# EAGLE design PW_portable (EAGLE 6.1)
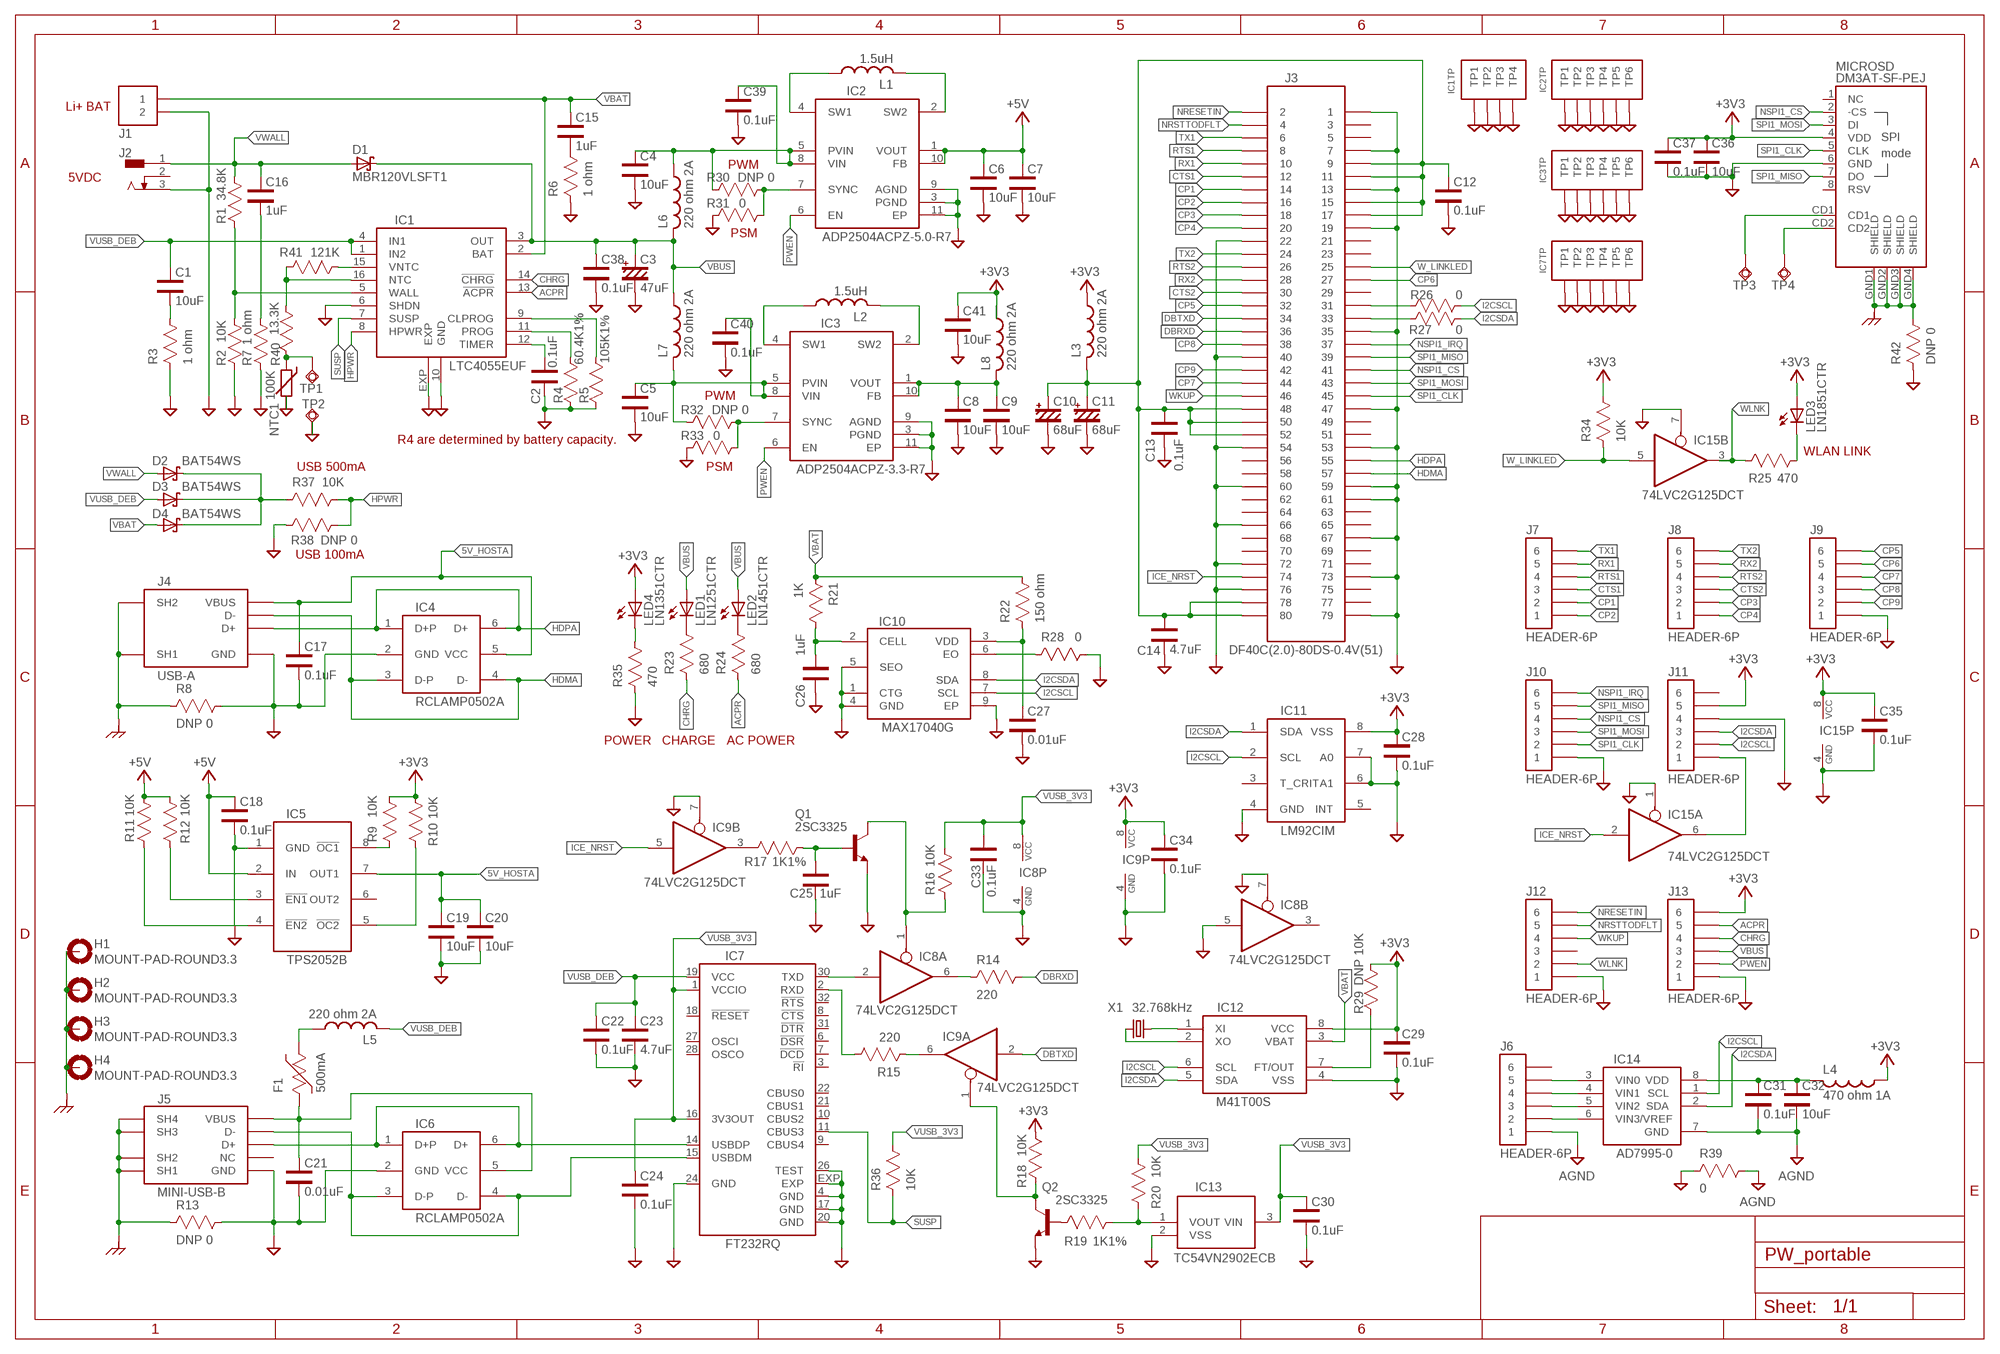
[diagram p0: schematic, sheet 1]

## Parts
C1  10uF  C0603  [C0603]
C2  0.1uF  C0603  [C0603]
C3  47uF  CPSMC_D  [SMC_D]
C4  10uF  C0603  [C0603]
C5  10uF  C0603  [C0603]
C6  10uF  C0603  [C0603]
C7  10uF  C0603  [C0603]
C8  10uF  C0603  [C0603]
C9  10uF  C0603  [C0603]
C10  68uF  CPSMC_D  [SMC_D]
C11  68uF  CPSMC_D  [SMC_D]
C12  0.1uF  C0603  [C0603]
C13  0.1uF  C0603  [C0603]
C14  4.7uF  C0603  [C0603]
C15  1uF  C0603  [C0603]
C16  1uF  C0603  [C0603]
C17  0.1uF  C0603  [C0603]
C18  0.1uF  C0603  [C0603]
C19  10uF  C0603  [C0603]
C20  10uF  C0603  [C0603]
C21  0.01uF  C0603  [C0603]
C22  0.1uF  C0603  [C0603]
C23  4.7uF  C0603  [C0603]
C24  0.1uF  C0603  [C0603]
C25  1uF  C0603  [C0603]
C26  1uF  C0603  [C0603]
C27  0.01uF  C0603  [C0603]
C28  0.1uF  C0603  [C0603]
C29  0.1uF  C0603  [C0603]
C30  0.1uF  C0603  [C0603]
C31  0.1uF  C0603  [C0603]
C32  10uF  C0603  [C0603]
C33  0.1uF  C0603  [C0603]
C34  0.1uF  C0603  [C0603]
C35  0.1uF  C0603  [C0603]
C36  10uF  C0603  [C0603]
C37  0.1uF  C0603  [C0603]
C38  0.1uF  C0603  [C0603]
C39  0.1uF  C0603  [C0603]
C40  0.1uF  C0603  [C0603]
C41  10uF  C0603  [C0603]
D1  MBR120VLSFT1  [SOD123FL]
D2  BAT54WS  [SOD323]
D3  BAT54WS  [SOD323]
D4  BAT54WS  [SOD323]
F1  500mA  NANOSMDC050F/13  [P1206]
H1  MOUNT-PAD-ROUND3.3  [3,3-PAD]
H2  MOUNT-PAD-ROUND3.3  [3,3-PAD]
H3  MOUNT-PAD-ROUND3.3  [3,3-PAD]
H4  MOUNT-PAD-ROUND3.3  [3,3-PAD]
IC1  LTC4055EUF  [QFN16-4X4]
IC2  ADP2504ACPZ-5.0-R7  [LFCSP_WD-CP-10-9]
IC3  ADP2504ACPZ-3.3-R7  [LFCSP_WD-CP-10-9]
IC4  RCLAMP0502A  [SOT666]
IC5  TPS2052B  [D_R-PDSO-G08]
IC6  RCLAMP0502A  [SOT666]
IC7  FT232RQ  [QFN32]
IC8  74LVC2G125DCT  [SSOP08]
IC9  74LVC2G125DCT  [SSOP08]
IC10  MAX17040G  [8-TDFN]
IC11  LM92CIM  [SO08]
IC12  M41T00S  [SO08]
IC13  TC54VN2902ECB  [SOT23]
IC14  AD7995-0  [SOT23-8]
IC15  74LVC2G125DCT  [SSOP08]
J1  JACK-JST-2P-PW'SMD'  [JST-SMD-2.0]
J2  DCJ0202  [DCJ0202]
J3  DF40C(2.0)-80DS-0.4V(51)  [DF40C(2.0)-80DS-0.4V(51)]
J4  USB-A  USB-AL  [USB-A]
J5  MINI-USB-B  [1734035-2]
J6  HEADER-6P  [6P-2.54]
J7  HEADER-6P  [6P-2.54]
J8  HEADER-6P  [6P-2.54]
J9  HEADER-6P  [6P-2.54]
J10  HEADER-6P  [6P-2.54]
J11  HEADER-6P  [6P-2.54]
J12  HEADER-6P  [6P-2.54]
J13  HEADER-6P  [6P-2.54]
L1  1.5uH  LQM2HPN1R5MG0L  [L1008]
L2  1.5uH  LQM2HPN1R5MG0L  [L1008]
L3  220 ohm 2A  BLM18PG  [L0603]
L4  470 ohm 1A  BLM18PG  [L0603]
L5  220 ohm 2A  BLM18PG  [L0603]
L6  220 ohm 2A  BLM18PG  [L0603]
L7  220 ohm 2A  BLM18PG  [L0603]
L8  220 ohm 2A  BLM18PG  [L0603]
LED1  LN1251CTR  [LED1208]
LED2  LN1451CTR  [LED1208]
LED3  LN1851CTR  [LED1208]
LED4  LN1351CTR  [LED1208]
MICROSD  DM3AT-SF-PEJ  [DM3AT-SF-PEJ]
NTC1  100K  NTHS0603  [R0603]
Q1  2SC3325  [SOT23-BEC]
Q2  2SC3325  [SOT23-BEC]
R1  34.8K  R0603  [R0603]
R2  10K  R0603  [R0603]
R3  1 ohm  R0603  [R0603]
R4  60.4K1%  R0603  [R0603]
R5  105K1%  R0603  [R0603]
R6  1 ohm  R0603  [R0603]
R7  1 ohm  R0603  [R0603]
R8  DNP 0  R0603  [R0603]
R9  10K  R0603  [R0603]
R10  10K  R0603  [R0603]
R11  10K  R0603  [R0603]
R12  10K  R0603  [R0603]
R13  DNP 0  R0603  [R0603]
R14  220  R0603  [R0603]
R15  220  R0603  [R0603]
R16  10K  R0603  [R0603]
R17  1K1%  R0603  [R0603]
R18  10K  R0603  [R0603]
R19  1K1%  R0603  [R0603]
R20  10K  R0603  [R0603]
R21  1K  R0603  [R0603]
R22  150 ohm  R0603  [R0603]
R23  680  R0603  [R0603]
R24  680  R0603  [R0603]
R25  470  R0603  [R0603]
R26  0  R0603  [R0603]
R27  0  R0603  [R0603]
R28  0  R0603  [R0603]
R29  DNP 10K  R0603  [R0603]
R30  DNP 0  R0603  [R0603]
R31  0  R0603  [R0603]
R32  DNP 0  R0603  [R0603]
R33  0  R0603  [R0603]
R34  10K  R0603  [R0603]
R35  470  R0603  [R0603]
R36  10K  R0603  [R0603]
R37  10K  R0603  [R0603]
R38  DNP 0  R0603  [R0603]
R39  0  R0603  [R0603]
R40  13.3K  R0603  [R0603]
R41  121K  R0603  [R0603]
R42  DNP 0  R0603  [R0603]
TP1  TPSQTP20SQ  [TP20SQ]
TP2  TPSQTP20SQ  [TP20SQ]
TP3  TPSQTP20SQ  [TP20SQ]
TP4  TPSQTP20SQ  [TP20SQ]
X1  32.768kHz  CRYSTALFC255  [FC255]

## Nets
5V_HOSTA: C17.1 C19.1 C20.1 IC4.5(VCC) IC5.7(OUT1) J4.1(VBUS)
+3V3: C28.1 C29.1 C34.1 C35.1 C36.1 C37.1 C41.1 IC9.8(P:VCC) IC11.8(VSS) IC12.8(VCC) IC15.8(P:VCC) J11.5 J13.6 L3.1 L4.1 L8.1 LED3.A LED4.A MICROSD.4(VDD) R9.2 R10.2 R18.1 R29.2 R34.2
+5V: C6.1 C7.1 C18.1 IC2.1(VOUT) IC2.10(FB) IC5.2(IN) R11.2 R12.2
ACPR: IC1.13(!ACPR) J13.5 R24.1
AGND: C31.2 C32.2 IC14.7(GND) J6.1 R39.2
CHRG: IC1.14(!CHRG) J13.4 R23.1
CP1: J3.14 J7.2
CP2: J3.16 J7.1
CP3: J3.18 J8.2
CP4: J3.20 J8.1
CP5: J3.32 J9.6
CP6: J3.27 J9.5
CP7: J3.44 J9.4
CP8: J3.38 J9.3
CP9: J3.42 J9.2
CTS1: J3.12 J7.3
CTS2: J3.30 J8.3
DBRXD: J3.36 R14.2
DBTXD: IC9.2(A:I) J3.34
DGND: C2.2 C3.- C4.2 C5.2 C6.2 C7.2 C8.2 C9.2 C10.- C11.- C12.2 C13.2 C14.2 C17.2 C18.2 C19.2 C20.2 C21.2 C22.2 C23.2 C24.2 C25.2 C26.2 C27.2 C28.2 C29.2 C30.2 C33.2 C34.2 C35.2 C36.2 C37.2 C38.2 C39.2 C40.2 C41.2 IC1.6(SHDN) IC1.10(GND) IC1.EXP IC1.P$1(TP1) IC1.P$2(TP2) IC1.P$3(TP3) IC1.P$4(TP4) IC2.3(PGND) IC2.9(AGND) IC2.11(EP) IC2.P$1(TP1) IC2.P$2(TP2) IC2.P$3(TP3) IC2.P$4(TP4) IC2.P$5(TP5) IC2.P$6(TP6) IC3.3(PGND) IC3.9(AGND) IC3.11(EP) IC3.P$1(TP1) IC3.P$2(TP2) IC3.P$3(TP3) IC3.P$4(TP4) IC3.P$5(TP5) IC3.P$6(TP6) IC4.2(GND) IC5.1(GND) IC6.2(GND) IC7.4(GND) IC7.17(GND) IC7.20(GND) IC7.24(GND) IC7.26(TEST) IC7.EXP IC7.P$1(TP1) IC7.P$2(TP2) IC7.P$3(TP3) IC7.P$4(TP4) IC7.P$5(TP5) IC7.P$6(TP6) IC8.4(P:GND) IC8.5(B:I) IC8.7(B:OE) IC9.4(P:GND) IC9.7(B:OE) IC10.1(CTG) IC10.4(GND) IC10.5(SEO) IC10.9(EP) IC11.4(GND) IC11.6(A1) IC11.7(A0) IC12.4(VSS) IC13.2(VSS) IC15.1(A:OE) IC15.4(P:GND) IC15.7(B:OE) J1.2 J2.3 J3.1 J3.7 J3.13 J3.19 J3.22 J3.35 J3.40 J3.47 J3.53 J3.54 J3.59 J3.60 J3.61 J3.66 J3.67 J3.72 J3.73 J3.76 J3.79 J4.4(GND) J5.5(GND) J9.1 J10.1 J11.4 J12.1 J13.1 MICROSD.6(GND) NTC1.2 Q1.E Q2.E R2.1 R3.1 R4.1 R5.1 R6.1 R7.1 R8.2 R13.2 R28.2 R31.1 R33.1 R35.1 R38.1 R39.1 R42.1 TP2.TP
EGND: H1.B3,3(MOUNT) H2.B3,3(MOUNT) H3.B3,3(MOUNT) H4.B3,3(MOUNT) J4.5(SH1) J4.6(SH2) J5.M1(SH1) J5.M2(SH2) J5.M3(SH3) J5.M4(SH4) MICROSD.GND1(SHIELD) MICROSD.GND2(SHIELD) MICROSD.GND3(SHIELD) MICROSD.GND4(SHIELD) R8.1 R13.1 R42.2
HDMA: IC4.3(D-P) IC4.4(D-) J3.57 J4.2(D-)
HDPA: IC4.1(D+P) IC4.6(D+) J3.55 J4.3(D+)
HPWR: IC1.8(HPWR) R37.2 R38.2
I2CSCL: IC10.7(SCL) IC11.2(SCL) IC12.6(SCL) IC14.1(SCL) J11.2 R26.2
I2CSDA: IC10.8(SDA) IC11.1(SDA) IC12.5(SDA) IC14.2(SDA) J11.3 R27.2
ICE_NRST: IC9.5(B:I) IC15.2(A:I) J3.74
N$1: NTC1.1 R40.1 TP1.TP
N$2: C26.1 IC10.2(CELL) R21.2
N$3: C2.1 IC1.12(TIMER)
N$4: C27.1 IC10.3(VDD) R22.1
N$5: IC1.5(WALL) R1.1 R2.2
N$6: C1.2 R3.2
N$7: IC1.11(PROG) R4.2
N$8: IC1.9(CLPROG) R5.2
N$9: IC2.4(SW1) L1.1
N$10: IC2.2(SW2) L1.2
N$11: IC3.4(SW1) L2.1
N$12: IC3.2(SW2) L2.2
N$13: C10.+ C11.+ C12.1 C13.1 C14.1 J3.9 J3.11 J3.15 J3.17 J3.48 J3.50 J3.52 J3.78 J3.80 L3.2
N$14: C16.2 R7.2
N$15: IC5.3(!EN1) R12.1
N$16: IC5.8(!OC1) R9.1
N$17: IC5.5(!OC2) R10.1
N$18: C15.2 R6.2
N$19: IC5.4(!EN2) R11.1
N$20: IC8.1(A:OE) Q1.C R16.1
N$21: IC6.1(D+P) IC6.6(D+) IC7.14(USBDP) J5.3(D+)
N$22: C21.1 F1.1 IC6.5(VCC) J5.1(VBUS)
N$23: IC6.3(D-P) IC6.4(D-) IC7.15(USBDM) J5.2(D-)
N$24: C25.1 Q1.B R17.1
N$25: IC9.1(A:OE) Q2.C R18.2
N$26: Q2.B R19.1
N$27: IC7.30(TXD) IC8.2(A:I)
N$28: IC7.2(RXD) R15.2
N$29: IC9.6(A:O) R15.1
N$30: IC8.6(A:O) R14.1
N$31: IC13.1(VOUT) R19.2 R20.1
N$32: IC10.6(EO) R28.1
N$33: IC9.3(B:O) R17.2
N$34: C31.1 C32.1 IC14.8(VDD) L4.2
N$35: IC12.2(XO) X1.1
N$36: LED1.C R23.2
N$37: LED2.C R24.2
N$38: IC14.6(VIN3/VREF) J6.2
N$39: IC14.5(VIN2) J6.3
N$40: IC14.4(VIN1) J6.4
N$41: IC14.3(VIN0) J6.5
N$42: IC15.6(A:O) J11.1
N$43: LED3.C R25.2
N$44: MICROSD.CD1 TP3.TP
N$45: IC12.1(XI) X1.2
N$46: IC12.7(FT/OUT) R29.1
N$47: J3.31 R26.1
N$48: J3.33 R27.1
N$49: IC2.7(SYNC) R30.2 R31.2
N$50: IC3.7(SYNC) R32.2 R33.2
N$51: MICROSD.CD2 TP4.TP
N$52: LED4.C R35.2
N$53: F1.2 L5.1
N$54: C5.1 C40.1 IC3.5(PVIN) IC3.8(VIN) L7.2 R32.1
N$55: C4.1 C39.1 IC2.5(PVIN) IC2.8(VIN) L6.1 R30.1
N$56: D2.C D3.C D4.C R37.1
N$57: IC1.15(VNTC) R41.1
N$58: IC1.16(NTC) R40.2 R41.2
N$59: C8.1 C9.1 IC3.1(VOUT) IC3.10(FB) L8.2
NRESETIN: J3.2 J12.6
NRSTTODFLT: J3.4 J12.5
NSPI1_CS: J3.41 J10.4 MICROSD.2(-CS)
NSPI1_IRQ: J3.37 J10.6
PWEN: IC2.6(EN) IC3.6(EN) J13.2
RTS1: J3.8 J7.4
RTS2: J3.26 J8.4
RX1: J3.10 J7.5
RX2: J3.28 J8.5
SPI1_CLK: J3.45 J10.2 MICROSD.5(CLK)
SPI1_MISO: J3.39 J10.5 MICROSD.7(DO)
SPI1_MOSI: J3.43 J10.3 MICROSD.3(DI)
SUSP: IC1.7(SUSP) IC7.11(CBUS3) R36.1
TX1: J3.6 J7.6
TX2: J3.24 J8.6
VBAT: C15.1 D4.A IC1.2(BAT) IC12.3(VBAT) J1.1 R21.1 R22.2
VBUS: C3.+ C38.1 D1.C IC1.3(OUT) J13.3 L6.2 L7.1 LED1.A LED2.A
VUSB_3V3: C24.1 C30.1 C33.1 IC7.1(VCCIO) IC7.16(3V3OUT) IC8.8(P:VCC) IC13.3(VIN) R16.2 R20.2 R36.2
VUSB_DEB: C1.1 C22.1 C23.1 D3.A IC1.1(IN2) IC1.4(IN1) IC7.19(VCC) L5.2
VWALL: C16.1 D1.A D2.A J2.1 R1.2
W_LINKLED: IC15.5(B:I) J3.25 R34.1
WKUP: J3.46 J12.4
WLNK: IC15.3(B:O) J12.2 R25.1
Unconnected: IC5.6(OUT2) IC7.3(!RI) IC7.6(!DSR) IC7.7(!DCD) IC7.8(!CTS) IC7.9(CBUS4) IC7.10(CBUS2) IC7.18(!RESET) IC7.21(CBUS1) IC7.22(CBUS0) IC7.27(OSCI) IC7.28(OSCO) IC7.31(!DTR) IC7.32(!RTS) IC8.3(B:O) IC11.3(T_CRIT) IC11.5(INT) J2.2 J3.3 J3.5 J3.21 J3.23 J3.29 J3.49 J3.51 J3.56 J3.58 J3.62 J3.63 J3.64 J3.65 J3.68 J3.69 J3.70 J3.71 J3.75 J3.77 J5.4(NC) J6.6 J11.6 J12.3 MICROSD.1(NC) MICROSD.8(RSV)

## Notes on the sheet
- Li+ BAT
- PWM
- 5VDC
- PSM
- PWM
- R4 are determined by battery capacity.
- WLAN LINK
- USB 500mA | PSM
- USB 100mA
- POWER | CHARGE | AC POWER

## Library data of the parts
C1 C2 C4-C9 C12-C41 = PWLib:C
C3 C10 C11 = PWLib:CP
D1 = PWLib:MBR120VLSFT1: Schottky Power Rectifier Source: http://www.onsemi.com/pub/Collateral/MBR120VLSFT1-D.pdf
D2-D4 = PWLib:BAT54WS: Schottky Power Rectifier
F1 = PWLib:NANOSMDC050F/13
H1-H4 = holes:MOUNT-PAD-ROUND: MOUNTING PAD, round
IC1 = PWLib:LTC4055EUF
IC2 IC3 = PWLib:ADP2504ACPZ-?-R7
IC4 IC6 = PWLib:RCLAMP0502A
IC5 = PWLib:TPS2052B
IC7 = PWLib:FT232R: Source: http://www.ftdichip.com/Documents/DataSheets/DS_FT232R_v104.pdf; MPN: FT232RQ; OC_FARNELL: 1146033; OC_NEWARK: 91K9919
IC8 IC9 IC15 = PWLib:74*2G125: Dual line drivers with 3-state outputs.
IC10 = PWLib:MAX17040*
IC11 = PWLib:LM92CIM
IC12 = PWLib:M41T00S
IC13 = PWLib:TC54VN*02E?
IC14 = PWLib:AD799*-
J1 = PWLib:JACK-JST-2P-PW
J2 = PWLib:DCJ0202: DC POWER JACK Source: DCJ0202.pdf; OC_FARNELL: unknown; OC_NEWARK: unknown
J3 = PWLib:DF40C(2.0)-80DS-0.4V(51)
J4 = PWLib:USB-A: USB-A Conector
J5 = PWLib:MINI-USB-B: MINI USB-B Conector
J6-J13 = PWLib:HEADER-6P
L1 L2 = PWLib:LQM2HPN1R5MG0L: INDUCTOR, American symbol
L3-L8 = PWLib:BLM?PG
LED1-LED4 = PWLib:LN*51CTR: CHIP TYPE LED LNxx51CTR
MICROSD = PWLib:DM3AT-SF-PEJ: HIROSE microSD socket DM3AT-SF-PEJ
NTC1 = PWLib:NTHS0603: Thermo Resistor
Q1 Q2 = PWLib:2SC3325
R1-R42 = PWLib:R
TP1-TP4 = testpad:TPSQ: Test pad
X1 = PWLib:CRYSTAL: CRYSTAL

## Board
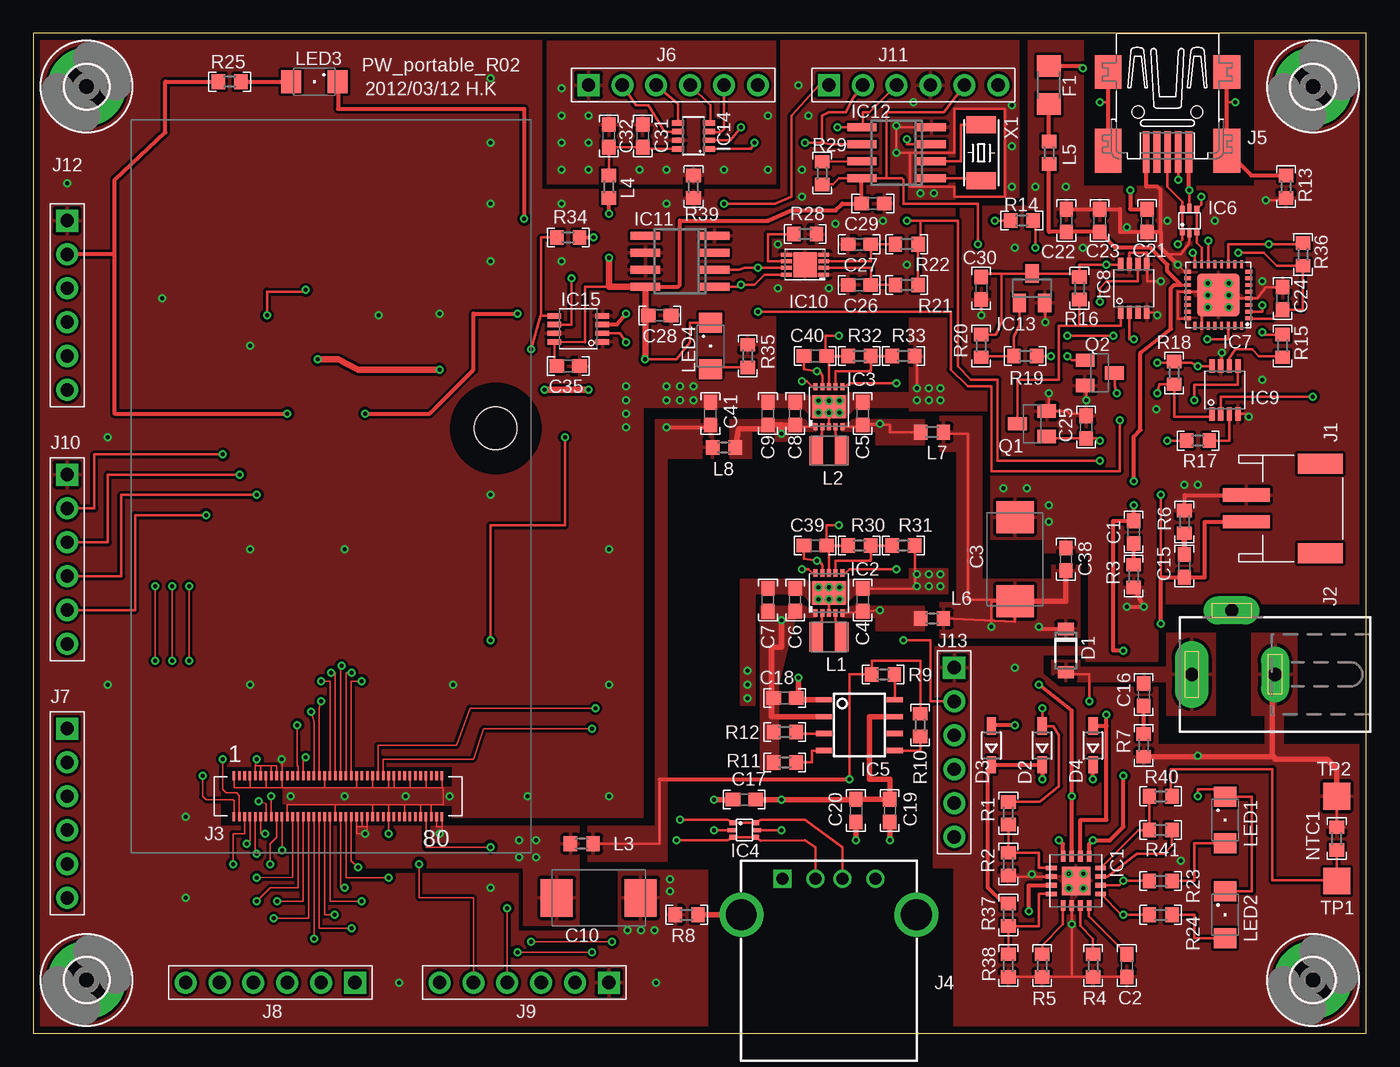
[diagram p1: board, top side]
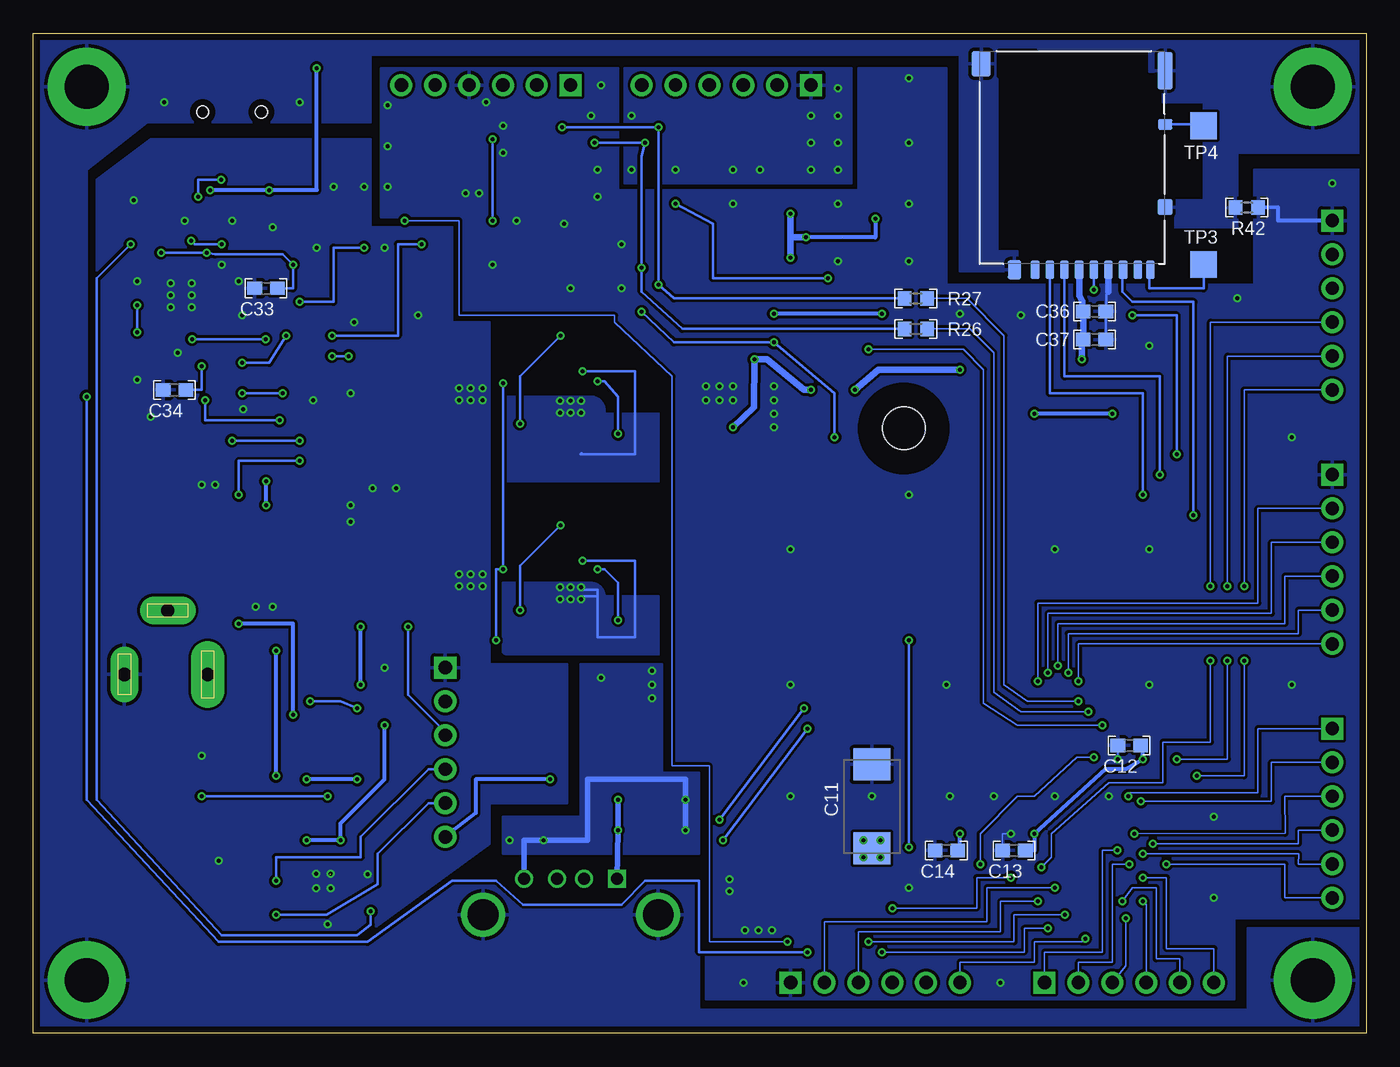
[diagram p2: board, bottom side, seen from below]

Size 100 x 75 mm. Coordinates in mm from the lower left corner, seen from the top.
Outline: 0,0 100,0 100,75 0,75 0,0
Copper layers (1*16): Top 0.035mm / dielectric 1.53mm / Bottom 0.035mm
Design rules: minimum track width 5mil, minimum drill 0.3mm, track to track 5mil, track to pad 0.229mm, pad to pad 5mil, via to via 5mil, smd to smd 5mil, copper to edge 0.5mm, drill to drill 0.5mm, minimum pad ring 0.15mm, minimum via ring 0.15mm, stop-mask expansion 4mil, vias tented up to drill 0.35mm, thermal gap 10mil

### Footprints (pad centres in the part's own frame; a part is rotated, then mirrored left to right if it is on the bottom)
C0603 = smd 1.1 x 1: 1 -0.85,0; 2 0.85,0
SMC_D = smd 2.4 x 2.8: + -3.15,0; - 3.15,0
SOD123FL = smd 0.91 x 1.22: A 1.625,0; C -1.625,0
SOD323 = smd 1.3 x 0.7: A 1.45,0; C -1.45,0
P1206 = smd 1.6 x 1.803: 1 -1.422,0; 2 1.422,0
3,3-PAD = drill 3.3 pad 5.842: B3,3 0,0
QFN16-4X4 = smd 0.8 x 0.35: 1 -1.85,0.975; 2 -1.85,0.325; 3 -1.85,-0.325; 4 -1.85,-0.975; 9 1.85,-0.975; 10 1.85,-0.325; 11 1.85,0.325; 12 1.85,0.975 | smd 0.35 x 0.8: 5 -0.975,-1.85; 6 -0.325,-1.85; 7 0.325,-1.85; 8 0.975,-1.85; 13 0.975,1.85; 14 0.325,1.85; 15 -0.325,1.85; 16 -0.975,1.85 | smd 2.15 x 2.15: EXP 0,0 | drill 0.3: P$1 -0.535,0.535; P$2 0.535,0.535; P$3 -0.535,-0.535; P$4 0.535,-0.535
LFCSP_WD-CP-10-9 = smd 0.55 x 0.3: 1 -1.5,1; 2 -1.5,0.5; 3 -1.5,0; 4 -1.5,-0.5; 5 -1.5,-1; 6 1.5,-1; 7 1.5,-0.5; 8 1.5,0; 9 1.5,0.5; 10 1.5,1 | smd 1.74 x 2.48: 11 0,0 | drill 0.3: P$1 -0.45,0.8; P$2 0.45,0.8; P$3 -0.45,0; P$4 0.45,0; P$5 -0.45,-0.8; P$6 0.45,-0.8
SOT666 = smd 0.375 x 0.5: 1 -0.537,-0.85; 3 0.538,-0.85; 4 0.538,0.849; 6 -0.538,0.85 | smd 0.3 x 0.65: 2 0,-0.923; 5 0,0.925
D_R-PDSO-G08 = smd 0.4 x 1.2: 1 -1.905,-2.65; 2 -0.635,-2.65; 3 0.635,-2.65; 4 1.905,-2.65; 5 1.905,2.65; 6 0.635,2.65; 7 -0.635,2.65; 8 -1.905,2.65
QFN32 = smd 0.6 x 0.3: 1 -2.3,1.75; 2 -2.3,1.25; 3 -2.3,0.75; 4 -2.3,0.25; 5 -2.3,-0.25; 6 -2.3,-0.75; 7 -2.3,-1.25; 8 -2.3,-1.75; 17 2.3,-1.75; 18 2.3,-1.25; 19 2.3,-0.75; 20 2.3,-0.25; 21 2.3,0.25; 22 2.3,0.75; 23 2.3,1.25; 24 2.3,1.75 | smd 0.3 x 0.6: 9 -1.75,-2.3; 10 -1.25,-2.3; 11 -0.75,-2.3; 12 -0.25,-2.3; 13 0.25,-2.3; 14 0.75,-2.3; 15 1.25,-2.3; 16 1.75,-2.3; 25 1.75,2.3; 26 1.25,2.3; 27 0.75,2.3; 28 0.25,2.3; 29 -0.25,2.3; 30 -0.75,2.3; 31 -1.25,2.3; 32 -1.75,2.3 | smd 3.2 x 3.2: EXP 0,0 | drill 0.3: P$1 -0.8,0.9; P$2 0.8,0.9; P$3 -0.8,0; P$4 0.8,0; P$5 -0.8,-0.9; P$6 0.8,-0.9
SSOP08 = smd 0.4 x 1: 1 -0.975,-1.8; 2 -0.325,-1.8; 3 0.325,-1.8; 4 0.975,-1.8; 5 0.975,1.8; 6 0.325,1.8; 7 -0.325,1.8; 8 -0.975,1.8
8-TDFN = smd 0.8 x 0.3: 1 -1.4,0.75; 2 -1.4,0.25; 3 -1.4,-0.25; 4 -1.4,-0.75; 5 1.4,-0.75; 6 1.4,-0.25; 7 1.4,0.25; 8 1.4,0.75 | smd 1.73 x 1.88: 9 0,0
SO08 = smd 0.6 x 2.2: 1 -1.905,-2.6; 2 -0.635,-2.6; 3 0.635,-2.6; 4 1.905,-2.6; 5 1.905,2.6; 6 0.635,2.6; 7 -0.635,2.6; 8 -1.905,2.6
SOT23 = smd 1 x 1.4: 1 -0.95,-1.1; 2 0.95,-1.1; 3 0,1.1
SOT23-8 = smd 0.4 x 0.9: 1 -0.975,-1.15; 2 -0.325,-1.15; 3 0.325,-1.15; 4 0.975,-1.15; 5 0.975,1.15; 6 0.325,1.15; 7 -0.325,1.15; 8 -0.975,1.15
JST-SMD-2.0 = smd 1 x 3.5: 1 -1,4.25; 2 1,4.25 | smd 1.5 x 3.4: P$1 -3.35,-1.3; P$2 3.35,-1.3
DCJ0202 = drill 1 pad 2.5 long: 1 0,3 | drill 1 pad 2.1 long: 2 4.8,0; 3 0,-3.25
DF40C(2.0)-80DS-0.4V(51) = smd 0.2 x 0.7: 1 -7.8,1.54; 2 -7.8,-1.54; 3 -7.4,1.54; 4 -7.4,-1.54; 5 -7,1.54; 6 -7,-1.54; 7 -6.6,1.54; 8 -6.6,-1.54; 9 -6.2,1.54; 10 -6.2,-1.54; 11 -5.8,1.54; 12 -5.8,-1.54; 13 -5.4,1.54; 14 -5.4,-1.54; 15 -5,1.54; 16 -5,-1.54; 17 -4.6,1.54; 18 -4.6,-1.54; 19 -4.2,1.54; 20 -4.2,-1.54; 21 -3.8,1.54; 22 -3.8,-1.54; 23 -3.4,1.54; 24 -3.4,-1.54; 25 -3,1.54; 26 -3,-1.54; 27 -2.6,1.54; 28 -2.6,-1.54; 29 -2.2,1.54; 30 -2.2,-1.54; 31 -1.8,1.54; 32 -1.8,-1.54; 33 -1.4,1.54; 34 -1.4,-1.54; 35 -1,1.54; 36 -1,-1.54; 37 -0.6,1.54; 38 -0.6,-1.54; 39 -0.2,1.54; 40 -0.2,-1.54; 41 0.2,1.54; 42 0.2,-1.54; 43 0.6,1.54; 44 0.6,-1.54; 45 1,1.54; 46 1,-1.54; 47 1.4,1.54; 48 1.4,-1.54; 49 1.8,1.54; 50 1.8,-1.54; 51 2.2,1.54; 52 2.2,-1.54; 53 2.6,1.54; 54 2.6,-1.54; 55 3,1.54; 56 3,-1.54; 57 3.4,1.54; 58 3.4,-1.54; 59 3.8,1.54; 60 3.8,-1.54; 61 4.2,1.54; 62 4.2,-1.54; 63 4.6,1.54; 64 4.6,-1.54; 65 5,1.54; 66 5,-1.54; 67 5.4,1.54; 68 5.4,-1.54; 69 5.8,1.54; 70 5.8,-1.54; 71 6.2,1.54; 72 6.2,-1.54; 73 6.6,1.54; 74 6.6,-1.54; 75 7,1.54; 76 7,-1.54; 77 7.4,1.54; 78 7.4,-1.54; 79 7.8,1.54; 80 7.8,-1.54 | hole 3.2: 11.836,27.584
USB-A = drill 0.9 pad 1.27 square: 1 3.5,-2.71 | drill 0.9 pad 1.27: 2 1,-2.71; 3 -1,-2.71; 4 -3.5,-2.71 | drill 2.3 pad 3.048: 5 6.57,0; 6 -6.57,0
1734035-2 = smd 3.1 x 0.5: 1 3,1.6; 2 3,0.8; 3 3,0; 4 3,-0.8; 5 3,-1.6 | smd 2.5 x 2: M1 -3,-4.45; M2 -3,4.45 | smd 3.3 x 2: M3 2.9,4.45; M4 2.9,-4.45 | hole 0.9: 0,2.2; 0,-2.2
6P-2.54 = drill 1 pad 1.651 square: 1 0,6.35 | drill 1 pad 1.651: 2 0,3.81; 3 0,1.27; 4 0,-1.27; 5 0,-3.81; 6 0,-6.35
L1008 = smd 1 x 2.2: 1 -0.95,0; 2 0.95,0
L0603 = smd 1 x 1.1: 1 -0.85,0; 2 0.85,0
LED1208 = smd 1.5 x 1.7: A -1.75,0; C 1.75,0
DM3AT-SF-PEJ = smd 0.65 x 1.4: 1 3.2,16.4; 2 2.1,16.4; 3 1,16.4; 4 -0.1,16.4; 5 -1.2,16.4; 6 -2.3,16.4; 7 -3.4,16.4; 8 -4.5,16.4; CD1 -5.45,16.4 | smd 1.1 x 0.8: CD2 -6.55,5.5 | smd 1.1 x 2.8: GND1 -6.55,1.475 | smd 1.4 x 1.9: GND2 7.25,0.95 | smd 1 x 1.4: GND3 4.75,16.4 | smd 1.1 x 1.2: GND4 -6.55,11.7
R0603 = smd 1 x 1.1: 1 -0.85,0; 2 0.85,0
SOT23-BEC = smd 1 x 1.4: B -0.95,-1.1; C 0,1.1; E 0.95,-1.1
TP20SQ = smd 2 x 2: TP 0,0
FC255 = smd 1.3 x 2.2: 1 -2.1,0; 2 2.1,0

### Placement (x,y rotation side)
C1  82.55,37.59 270 top
C2  82.04,5.08 270 top
C3  73.66,35.56 90 top
C4  62.23,32.51 90 top
C5  62.23,46.48 90 top
C6  57.15,32.51 90 top
C7  55.12,32.51 90 top
C8  57.15,46.48 90 top
C9  55.12,46.48 90 top
C10  42.42,10.16 0 top
C11  37.08,17.02 90 bottom
C12  17.78,21.59 180 bottom
C13  26.42,13.72 180 bottom
C14  31.5,13.72 180 bottom
C15  86.36,35.05 90 top
C16  83.31,25.4 270 top
C17  53.34,17.53 180 top
C18  56.39,25.15 0 top
C19  64.26,16.7 270 top
C20  61.72,16.7 270 top
C21  83.57,60.96 270 top
C22  77.51,60.96 90 top
C23  80,60.96 90 top
C24  93.73,55.12 90 top
C25  78.99,45.47 90 top
C26  61.98,56.13 180 top
C27  61.98,59.18 180 top
C28  46.99,53.85 0 top
C29  62.99,62.23 0 top
C30  71.12,55.88 270 top
C31  45.72,67.31 90 top
C32  43.18,67.31 90 top
C33  82.55,55.88 180 bottom
C34  89.41,48.26 180 bottom
C35  40.13,50.04 0 top
C36  20.38,54.15 0 bottom
C37  20.38,52.03 0 bottom
C38  77.47,35.56 90 top
C39  58.67,36.58 180 top
C40  58.67,50.8 180 top
C41  50.8,46.48 90 top
D1  77.47,28.7 270 top
D2  75.69,21.59 90 top
D3  71.88,21.59 90 top
D4  79.5,21.59 90 top
F1  76.2,71.12 270 top
H1  4,71 0 top
H2  96,71 0 top
H3  96,4 0 top
H4  4,4 0 top
IC1  78.23,11.43 270 top
IC2  59.69,33.02 90 top
IC3  59.69,46.99 90 top
IC4  53.34,15.24 270 top
IC5  61.98,23.11 270 top
IC6  86.74,60.96 0 top
IC7  88.9,55.37 180 top
IC8  82.55,55.88 0 top
IC9  89.41,48.26 0 top
IC10  57.91,57.66 180 top
IC11  48.51,57.91 90 top
IC12  64.77,66.04 90 top
IC13  74.93,55.88 0 top
IC14  49.53,67.31 90 top
IC15  40.89,52.83 90 top
J1  95.25,39.37 90 top
J2  89.92,26.92 90 top
J3  22.86,17.78 0 top
J4  59.69,8.89 180 top
J5  85.09,69.09 270 top
J6  48.01,71.12 90 top
J7  2.54,16.51 0 top
J8  17.78,3.81 270 top
J9  36.83,3.81 270 top
J10  2.54,35.56 0 top
J11  66.04,71.12 90 top
J12  2.54,54.61 0 top
J13  69.09,21.08 0 top
L1  59.69,29.72 180 top
L2  59.69,43.69 180 top
L3  41.15,14.22 180 top
L4  43.18,63.5 90 top
L5  76.2,66.04 270 top
L6  67.44,31.11 0 top
L7  67.44,45.09 180 top
L8  51.82,43.94 0 top
LED1  89.41,16 270 top
LED2  89.41,8.89 270 top
LED3  21.08,71.37 180 top
LED4  50.8,51.56 270 top
MICROSD  21.64,73.67 180 bottom
NTC1  97.79,14.61 90 top
Q1  74.93,45.72 90 top
Q2  80.01,49.53 270 top
R1  73.15,16.51 90 top
R2  73.15,12.7 90 top
R3  82.55,34.29 90 top
R4  79.5,5.08 90 top
R5  75.69,5.08 90 top
R6  86.36,38.35 270 top
R7  83.31,21.59 90 top
R8  49.02,8.89 180 top
R9  63.75,26.92 180 top
R10  66.55,23.11 90 top
R11  56.39,20.32 180 top
R12  56.39,22.61 180 top
R13  93.98,63.5 270 top
R14  74.17,60.96 180 top
R15  93.73,51.56 90 top
R16  78.49,55.88 90 top
R17  87.38,44.45 0 top
R18  85.6,49.53 270 top
R19  74.42,50.8 180 top
R20  71.12,51.56 90 top
R21  65.53,56.13 180 top
R22  65.53,59.18 0 top
R23  84.58,11.43 0 top
R24  84.58,8.89 0 top
R25  14.73,71.37 0 top
R26  33.78,52.83 180 bottom
R27  33.78,55.12 180 bottom
R28  57.91,59.94 0 top
R29  59.18,64.52 270 top
R30  61.98,36.58 0 top
R31  65.28,36.58 180 top
R32  61.98,50.8 0 top
R33  65.28,50.8 180 top
R34  40.13,59.69 0 top
R35  53.59,50.8 270 top
R36  95.25,58.42 270 top
R37  73.15,8.89 270 top
R38  73.15,5.08 90 top
R39  49.53,63.5 90 top
R40  84.58,17.78 180 top
R41  84.58,15.24 180 top
R42  8.95,61.93 180 bottom
TP1  97.79,11.43 0 top
TP2  97.79,17.78 0 top
TP3  12.19,57.66 0 bottom
TP4  12.19,68.07 0 bottom
X1  71.12,66.04 270 top

### Tracks (layer width: path | path; a pad name or v marks a point on that pad's centre or on a via)
5V_HOSTA  (via drill 0.3)
  Top 0.2: v56.13,15.24 IC4.5
  Top 0.4: C17.1 v56.13,17.53 61.72,17.53 C20.1 C19.1 64.26,19.05 62.74,19.05 62.74,23.75 IC5.7
  Bottom 0.4: v56.13,17.53 v56.13,15.24 J4.1
+3V3  (via drill 0.3)
  Top 0.2: R10.2 66.55,27.94 62.9,27.94 R9.2 62.74,26.75 62.74,26.92 61.21,26.92 v61.21,19.05 | IC9.8 88.41,50.04 v87.38,50.04 86.87,50.29 85.6,50.29 | 85.6,50.29 R18.1 | v84.32,50.29 85.6,50.29 | v77.6,52.32 v81.03,52.32 | 46.99,19.05 46.99,14.22 L3.1 | IC12.8 64.01,64.14 | 64.01,64.14 64.01,69.09 68.33,69.09 J11.5 | IC12.8 60.45,64.14 59.98,63.67 R29.2 | 62.14,64.11 IC12.8 | 64.01,64.14 65.15,64.14 65.28,64.01 65.28,62.23 70.87,62.23 v70.87,59.18 | IC11.8 45.91,54.46 C28.1 | C35.1 39.12,50.29 IC15.8 41.4,51.82 41.4,56.01 43.18,56.01 | LED4.A 49.28,53.31 49.28,51.82 48.26,50.55 v45.91,50.55 | 22.86,71.35 LED3.A | L4.1 43.18,62.74
  Top 0.3: 46.99,19.05 v61.21,19.05 | 62.14,64.11 C29.1 60.71,62.23 60.2,61.72 56.9,61.72 55.12,60.96 48.51,60.96 48.51,56.13 48.39,56.01 IC11.8 | v47.5,45.47 50.63,45.47 C41.1 | v43.18,61.47 L4.1 | 22.86,71.35 22.86,69.34 36.83,69.34 v36.83,61.09 | R34.2 v42.04,59.69
  Top 0.5: v43.18,58.17 43.18,56.01 IC11.8 45.91,51.11 v45.91,50.55 | v21.34,50.55 22.86,50.55 24.38,49.78 v30.48,49.78 | v38.35,48.26 v41.66,48.26
  Bottom 0.2: v87.38,50.04 87.38,48.26 C34.1 | C36.1 21.28,54.28 | v84.32,50.29 82.3,50.29 v81.03,52.32 | v77.6,52.32 72.64,52.32 72.64,59.18 v70.87,59.18 | 21.34,51.92 C37.1
  Bottom 0.3: J13.6 66.8,16.51 66.8,19.05 v61.21,19.05 | v36.83,61.09 36.83,59.69 v42.04,59.69
  Bottom 0.5: C37.1 C36.1 | 21.28,54.28 21.28,54.9 21.54,55.33 MICROSD.4 | v47.5,45.47 45.92,46.97 v45.91,50.55 44.96,50.55 42.16,48.26 v41.66,48.26 | v21.34,50.55 21.34,51.92 | v43.18,58.17 43.18,59.69 | 43.18,59.69 v43.18,61.47 | v30.48,49.78 36.58,49.78 v38.35,48.26 | v42.04,59.69 43.18,59.69
  pour Top (isolate 0.2): 51.31,45.97 46.74,45.97 46.74,15.49 41.66,15.49 41.66,12.95 47.5,12.95 47.5,43.18 51.31,43.18
+5V  (via drill 0.3)
  Top 0.2: IC2.10 58.44,34.52 58.17,34.8 v57.66,34.8 | v56.13,30.99 56.22,30.73 C6.1
  Top 0.4: v56.13,30.99 56.13,28.96 55.37,28.96 55.37,23.75 IC5.2
  Bottom 0.2: v57.66,34.8 57.15,34.8 56.13,33.78 v56.13,30.99
  pour Top (isolate 0.127, no thermals): 55.88,26.16 57.15,31.24 58.67,31.24 58.67,31.75 58.29,31.75 57.91,32 54.61,32 54.61,19.81 55.88,19.81
ACPR  (via drill 0.3)
  Top 0.2: IC1.13 81.65,8.89 v81.79,8.89 R24.1
  Bottom 0.2: J13.5 70.36,17.27 74.17,13.46 74.17,11.18 77.98,8.89 v81.79,8.89
AGND  (via drill 0.3)
  other vias: 39.62,70.87 39.62,68.83 41.66,68.83 39.62,66.8 41.66,66.8 39.62,64.77 41.66,64.77 45.47,64.77 47.5,64.77 55.12,64.77 51.82,64.77 55.12,68.83
  pour Top (isolate 0.2): 38.61,74.42 55.63,74.42 55.63,63.75 38.61,63.75
  pour Bottom (isolate 0.2): 38.61,72.39 55.63,72.39 55.63,63.75 38.61,63.75
CHRG  (via drill 0.3)
  Top 0.2: IC1.14 81.46,11.11 v81.79,11.43 R23.1
  Bottom 0.2: J13.4 70.36,19.81 75.44,14.73 75.44,13.21 81.79,13.21 v81.79,11.43
CP1  (via drill 0.3)
  Top 0.127: J3.14 17.46,17.21 v16.89,17.4
  Bottom 0.127: v16.89,17.4 7.11,17.4 7.11,20.32 J7.2
CP2  (via drill 0.3)
  Top 0.127: v17.86,17.79 J3.16
  Bottom 0.127: v17.86,17.79 17.86,18.03 8.13,18.03 8.13,22.86 J7.1
CP3  (via drill 0.3)
  Top 0.127: J3.18 18.26,14.7 17.78,14.22 v17.78,12.7
  Bottom 0.127: v17.78,12.7 19.05,12.7 19.05,5.33 21.59,5.33 J8.2
CP4  (via drill 0.3)
  Top 0.127: J3.20 v18.66,13.72 v18.67,13.72
  Bottom 0.127: v18.67,13.72 19.81,13.72 19.81,6.1 24.13,6.1 J8.1
CP5  (via drill 0.3)
  Top 0.127: J3.32 21.06,7.11 v21.08,7.11
  Bottom 0.127: v21.08,7.11 21.34,6.86 24.89,6.86 24.89,5.33 30.48,5.33 J9.6
CP6  (via drill 0.3)
  Top 0.127: J3.27 20.26,20.57 v20.45,20.7 | J9.5 33.02,10.16 28.96,10.16 v28.96,12.7
  Bottom 0.127: v20.45,20.7 21.72,20.7 24.89,17.78 26.16,17.78 28.96,14.99 v28.96,12.7
CP7  (via drill 0.3)
  Top 0.127: J3.44 23.46,11.68 v26.67,11.68 | v35.56,9.4 J9.4
  Bottom 0.127: v26.67,11.68 29.21,11.68 29.21,9.4 v35.56,9.4
CP8  (via drill 0.3)
  Top 0.127: J3.38 22.26,9.91 v24.64,9.91
  Bottom 0.127: v24.64,9.91 27.43,9.91 27.43,7.62 38.1,7.62 J9.3
CP9  (via drill 0.3)
  Top 0.127: J3.42 23.06,10.92 v23.37,10.92
  Bottom 0.127: v23.37,10.92 28.45,10.92 28.45,8.38 40.64,8.38 J9.2
CTS1  (via drill 0.3)
  Top 0.127: J3.12 17.06,14.99 v17.4,14.99
  Bottom 0.127: v17.4,14.99 6.09,15 6.1,17.78 J7.3
CTS2  (via drill 0.3)
  Top 0.127: J3.30 20.66,8.64 v18.03,8.64
  Bottom 0.127: v18.03,8.64 18.03,5.08 J8.3
DBRXD  (via drill 0.3)
  Top 0.127: J3.36 21.86,8.89 v22.61,8.89 | v37.34,6.86 v43.43,6.86
  Top 0.2: v72.14,60.96 R14.2
  Bottom 0.127: v22.61,8.89 26.42,8.89 26.42,6.86 v37.34,6.86 | v43.43,6.86 49.28,6.86 49.28,20.07 52.07,20.07 52.07,49.28 56.39,53.34 56.39,53.85 68.07,53.85 68.07,60.96 v72.14,60.96
DBTXD  (via drill 0.3)
  Top 0.127: J3.34 21.46,7.87 v23.88,7.87 | v36.32,6.1 v41.91,6.1
  Top 0.2: IC9.2 89.08,47.75 v96.01,47.75
  Bottom 0.127: v23.88,7.87 25.65,7.87 25.65,6.1 v36.32,6.1
  Bottom 0.2: v96.01,47.75 96.01,17.53 86.11,6.86 74.93,6.86 68.58,11.43 65.28,11.43 63.25,9.65 55.88,9.65 54.1,11.43 50.04,11.43 50.04,6.1 v41.91,6.1
DGND  (via drill 0.3)  (1 unrouted)
  Top 0.127: 24.26,18.41 J3.47 | 24.26,18.41 21.91,18.41 arc-90 21.86,18.46 | 21.86,18.46 J3.35 | 18.66,18.41 J3.19 v18.66,20.57 v18.65,20.57 | 18.66,18.41 21.81,18.41 arc90 21.86,18.46 | J3.1 15.06,18.41 16.26,18.41 | 16.26,18.41 17.46,18.41 | 16.26,18.41 J3.7 | 17.46,18.41 J3.13 | 17.46,18.41 18.66,18.41 | v26.67,14.99 v26.66,14.99 J3.60 26.66,17.14 | 29.86,17.14 J3.76 | 29.06,17.14 J3.72 | 29.86,17.14 29.06,17.14 | 27.86,17.14 J3.66 | 29.06,17.14 27.86,17.14 | 29.86,17.14 30.73,17.14 30.73,18.41 30.66,18.41 | 27.86,17.14 26.66,17.14 | 25.46,17.14 J3.54 | 26.66,17.14 25.46,17.14 | 22.66,17.14 J3.40 | 25.46,17.14 22.66,17.14 | J3.22 19.06,17.14 22.66,17.14 | 30.66,18.41 J3.79 | 29.46,18.41 J3.73 | 29.46,18.41 30.66,18.41 | 28.26,18.41 J3.67 | 27.06,18.41 J3.61 | 27.06,18.41 28.26,18.41 | 26.66,18.41 J3.59 | 26.66,18.41 27.06,18.41 | 25.46,18.41 J3.53 | 25.46,18.41 26.66,18.41 | 28.26,18.41 29.46,18.41 | 24.26,18.41 25.46,18.41
  Top 0.2: IC2.3 IC2.11 | C4.2 66.13,33.36 R31.1 | IC4.2 v51.05,15.24 | IC2.9 59.19,35.04 arc90 v58.8,35.43 57.84,35.59 C39.2 | IC3.3 IC3.P$3 | IC1.10 77.91,4.23 R4.1 | R4.1 C2.2 | R4.1 R5.1 R38.1 | 77.91,11.43 IC1.EXP arc90 77.91,11.76 77.72,11.76 77.72,11.94 | TP2.TP NTC1.2 | IC1.6 73.25,11.76 arc-90 R2.1 | R33.1 66.29,50.8 v66.29,48.39 | IC3.9 59.19,49.27 arc90 v58.8,49.66 57.82,49.82 C40.2 | 89.92,55.37 arc90 90.17,55.12 IC7.4 91.82,55.12 92.46,55.97 C24.2 | 87.63,55.62 IC7.20 85.85,55.62 85.85,53.59 86.6,53.59 IC7.24 | IC7.26 87.65,54.36 | IC6.2 86.74,59.31 86.11,58.42 85.09,58.42 | IC7.17 86.57,57.15 86.36,57.15 v85.85,57.66 | IC9.4 91.12,46.48 v91.19,46.23 | IC8.4 84.26,54.05 v84.33,53.85 | IC9.7 89.15,50.13 v89.15,51.05 | v84.58,56.39 83.57,56.39 83.57,57.64 IC8.5 83.53,58.55 82.22,58.55 IC8.7 | R13.2 93.81,62.48 v92.46,62.48 | v76.2,48.01 76.2,46.84 Q1.E 77.54,46.67 77.72,46.48 78.83,46.48 C25.2 | Q2.E 78.99,48.5 v78.99,47.5 | IC13.2 arc-90 75.95,54.71 v75.95,53.34 | C30.2 v71.12,53.85 | IC12.4 64.77,67.94 v64.77,66.04 65.79,66.04 | 65.79,66.04 69.09,66.04 69.09,69.34 72.9,69.34 72.9,62.74 69.09,62.74 69.09,63.5 65.79,63.5 65.79,66.04
  Top 0.3: v85.85,57.66 85.09,58.42 84.58,58.93 84.58,60.11 | R3.1 v83.31,32 v82.04,32 | 84.58,60.11 C21.2 81.53,60.11 81.53,61.81 C23.2 C22.2 | J5.5 83.49,63.5 84.33,63.5 84.58,63.25 84.58,60.11 | R6.1 86.38,40.37 J1.2
  Top 0.4: 57.4,25.02 57.24,25.02 C18.2 | 57.4,25.02 v57.4,26.67 | 57.4,25.02 IC5.1 | v61.72,14.48 C20.2 | v64.26,14.48 C19.2 | R7.1 92.88,20.74 arc90 92.96,20.83 | 92.96,20.83 92.96,26.88 arc90 J2.3 | TP2.TP 97.79,19.81 97.03,20.57 93.22,20.57 92.96,20.83 | v51.05,17.53 C17.2
  Top 0.406: 87.65,54.36 88.1,54.36 IC7.P$2
  Bottom 0.127: v18.65,20.57 18.63,20.57 C12.2 | v26.67,14.99 27.3,14.99 27.3,13.72
  Bottom 0.2: 57.66,32.77 58.86,32.77 | 58.86,33.27 57.66,33.27 57.66,29.72 54.86,29.72 54.86,35.43 v58.8,35.43 | 58.86,43.5 58.93,43.43 54.86,43.43 54.86,49.66 v58.8,49.66 | 19.33,55.61 19.51,55.4 19.51,54.1 C36.2 C37.2
  Bottom 0.3: R42.1 6.6,61.95 6.6,60.96 J12.1
  Bottom 0.4: v51.05,15.24 v51.05,17.53 51.05,19.05 58.42,19.05 58.42,14.48 v61.72,14.48 63.2,14.48 J4.4
  Bottom 0.5: 19.33,55.61 MICROSD.6
  other vias: 53.59,27.18 53.59,26.16 53.59,25.15 72.77,40.89 76.2,38.35 74.55,40.89 76.2,39.62 66.29,34.42 67.18,34.42 68.07,34.42 66.29,33.53 67.18,33.53 68.07,33.53 67.18,48.39 68.07,48.39 66.29,47.5 67.18,47.5 68.07,47.5 86.36,41.15 87.38,41.15 44.58,7.75 45.59,7.75 46.61,7.75 47.75,10.67 47.75,11.56 47.5,48.51 48.51,48.51 49.53,48.51 47.5,47.5 48.51,47.5 49.53,47.5 39.62,62.23 73.41,66.55 47.5,62.23 73.41,63.5 64.77,68.07 34.29,62.23 66.55,62.99 67.56,62.99 57.4,71.12 58.17,68.83 66.04,69.85 73.41,69.6 57.66,64.77 57.66,62.74 60.2,60.71 63.75,60.96 59.69,55.88 55.88,55.88 55.88,59.18 65.53,57.66 44.45,48.51 44.45,47.5 44.45,46.48 44.45,45.47 39.62,57.91 30.48,53.98 34.29,57.91 73.66,58.93 78.74,58.93 77.47,63.5 75.18,63.5 82.04,60.45 85.09,60.96 88.65,60.96 92.2,56.39 92.2,49.02 84.27,46.79 74.93,11.94 86.08,12.95 87.38,20.83 73.66,27.43 34.29,10.92 27.43,3.81 46.74,3.81 11.43,10.16 11.43,16.26 5.59,26.16 16.26,26.16 43.18,17.78 43.18,26.16 31.5,26.16 25.91,53.85 16.26,51.56 16.26,36.32 23.37,36.32 2.54,63.75 9.65,55.12 5.59,44.7 34.29,40.39 43.18,36.32 34.29,66.8 77.92,8.19 19.3,17.78 23.37,17.78 27.94,17.78 31.24,17.78 37.08,17.78 34.29,71.63
  pour Top (isolate 0.127, no thermals): 53.09,24.64 54.1,24.64 54.1,33.02 57.66,33.02 58.42,32.26 60.96,32.26 61.72,33.02 68.58,33.02 68.58,34.8 65.79,34.8 65.79,34.04 61.21,34.04 60.96,33.78 58.17,33.78 57.91,34.04 53.09,34.04
  pour Bottom (isolate 0.2, no thermals): 53.09,32.77 57.15,32.77 arc-90 58.17,33.78 64.77,33.78 64.77,28.7 arc-90 64.52,28.45 53.09,28.45
  pour Bottom (isolate 0.2): 52.83,27.69 58.93,27.69 58.93,16.26 64.77,16.26 64.77,13.46 50.04,13.46 50.04,19.56 52.83,19.56
  pour Bottom (isolate 0.2): 65.79,53.34 68.58,53.34 68.58,60.45 74.68,60.45 74.68,67.06 91.19,67.06 95.25,64.01 95.25,17.53 85.85,7.62 76.2,7.62 76.2,13.21 76.45,13.46 85.6,13.46 91.19,19.05 91.19,28.7 93.22,30.73 93.22,34.29 65.79,34.29
  pour Top (isolate 0.127, no thermals): 44.45,49.02 52.32,49.02 52.32,48.39 55.63,48.39 55.63,47.88 57.78,47.88 58.42,47.75 60.96,47.75 61.21,48.01 65.79,48.01 65.79,48.77 68.58,48.77 68.58,46.99 61.72,46.99 60.96,46.23 58.42,46.23 57.66,46.99 44.45,46.99
  pour Bottom (isolate 0.2): 65.79,34.8 93.22,34.8 93.73,34.29 93.73,19.81 93.47,19.56 92.96,19.56 82.3,7.37 75.18,7.37 65.79,14.22 65.79,17.27 59.94,17.27 59.94,27.69 65.79,27.69
  pour Bottom (isolate 0.2): 53.09,41.4 64.77,41.4 64.77,47.75 58.17,47.75 arc90 57.15,46.74 57.15,46.48 53.09,46.48
  pour Top (isolate 0.2): -0.51,75.44 38.1,75.44 38.1,63.25 56.13,63.25 56.13,75.44 73.91,75.44 73.91,69.34 69.09,69.34 69.09,54.36 55.63,54.36 55.63,46.99 45.72,46.99 45.72,16.26 31.5,16.26 31.5,17.02 31.5,18.54 31.5,20.07 13.97,20.07 13.97,15.49 23.62,15.49 23.62,11.94 36.32,11.94 36.32,7.62 43.94,7.62 43.94,12.19 50.55,12.19 50.55,-0.51 -0.51,-0.51
  pour Bottom (isolate 0.2): 49.53,2.54 9.91,2.54 9.91,8.64 -0.51,8.64 -0.51,64.77 8.38,64.77 8.38,56.13 31.5,56.13 31.5,72.39 38.1,72.39 38.1,63.25 56.13,63.25 56.13,72.39 73.91,72.39 73.91,61.21 68.07,61.21 68.07,53.85 56.39,53.85 56.39,53.34 52.32,49.53 52.32,20.07 49.53,20.07
  pour Top (isolate 0.127, no thermals): 85.6,41.66 88.14,41.66 88.14,40.13 85.6,40.13
  pour Top (isolate 0.2): 72.9,69.6 73.91,69.6 73.91,62.74 72.9,62.74
  pour Top (isolate 0.2): 69.09,-1.78 69.09,12.45 67.56,12.45 67.56,28.96 79.25,28.96 79.25,36.07 75.95,36.07 75.95,37.08 71.88,37.08 71.88,46.74 65.79,46.74 65.79,53.59 69.6,53.59 69.6,61.98 74.68,61.98 74.68,75.69 78.74,75.69 78.74,63.5 91.69,63.5 91.69,75.69 100.58,75.69 100.58,32.26 84.33,32.26 84.33,27.94 78.99,27.94 78.99,28.45 75.69,28.45 75.69,26.92 76.96,25.91 84.33,25.91 84.33,21.59 100.58,21.59 100.58,-1.78
  pour Top (isolate 0.127): 31.75,18.41 18.8,18.41 18.8,17.14 31.75,17.14
  pour Top (isolate 0.2): 92.46,21.34 92.46,23.88 91.44,23.88 91.44,29.97 94.74,29.97 94.74,23.88 93.73,23.88 93.73,21.34
EGND  (via drill 0.3)
  Top 0.2: 80.64,69.85 v80.01,69.85 | 89.54,69.85 v90.17,69.85
  Top 0.3: J5.M4 80.64,69.85 J5.M1 | J5.M2 89.54,69.85 J5.M3 91.38,64.35 R13.1
  Top 0.4: R8.1 J4.5
  pour Bottom (isolate 0.2): -0.25,75.18 100.33,75.18 100.33,-0.25 -0.25,-0.25 -0.25,7.87 8.89,7.87 8.89,1.78 50.04,1.78 50.04,11.43 54.1,11.43 55.88,9.65 63.25,9.65 65.28,11.43 68.58,11.43 74.93,6.86 86.11,6.86 96.01,17.53 96.01,64.77 91.44,68.33 74.68,68.33 74.68,73.41 30.48,73.41 30.48,57.15 26.16,57.15 26.16,58.67 27.69,58.67 27.69,73.66 16.26,73.66 16.26,72.14 15.24,72.14 15.24,69.85 12.19,69.85 12.19,62.48 15.49,62.48 15.49,61.47 14.48,61.47 14.48,60.45 9.65,60.45 9.65,66.04 -0.25,66.04
HDMA  (via drill 0.3)
  Top 0.127: J3.57 26.26,20.57 33.02,20.57 33.78,22.86 v41.91,22.86
  Top 0.2: J4.2 58.67,13.97 57.91,14.48 54.61,14.45 IC4.4 IC4.3 52.07,14.48 v48.26,14.48
  Bottom 0.2: v41.91,22.86 v48.26,14.48
HDPA  (via drill 0.3)
  Top 0.127: J3.55 25.86,21.59 31.75,21.59 32.77,24.38 v42.16,24.38
  Top 0.2: J4.3 60.71,13.97 57.91,16 54.6,16 IC4.6 IC4.1 52.07,16 v48.51,16
  Bottom 0.2: v42.16,24.38 v48.51,16
HPWR
  Top 0.2: R38.2 R37.2 75.44,8.04 75.44,10.41 arc-90 75.48,10.46 IC1.8
I2CSCL  (via drill 0.3)
  Top 0.2: IC12.6 59.82,66.67 59.18,66.8 | 59.18,66.8 59.18,68.83 59.69,69.09 60.97,69.09 61.47,70.1 J11.2 | v57.91,66.8 59.18,66.8 | v54.1,66.8 53.85,66.33 IC14.1 | IC10.7 v54.36,57.4 53.34,57.4 52.96,57.28 IC11.2
  Bottom 0.2: v57.91,66.8 v54.1,66.8 54.36,65.79 v54.36,57.4 54.36,55.63 51.31,52.83 R26.2
I2CSDA  (via drill 0.3)
  Top 0.2: J11.3 62.75,69.1 62.75,69.09 62.23,69.09 62.23,68 IC12.5 v60.33,67.94 | v53.09,67.94 52.32,66.98 IC14.2 | IC10.8 54.86,56.9 54.1,56.13 v53.09,56.13 52.96,56.01 IC11.1
  Bottom 0.2: v60.33,67.94 v53.09,67.94 v53.09,56.13 51.94,55.12 R27.2
ICE_NRST  (via drill 0.3)
  Top 0.127: J3.74 29.46,14.22 29.46,13.97 v34.29,13.97
  Top 0.2: IC9.5 90.38,48.64 87.12,48.64 v87.12,47.5 | v81.53,45.97 81.53,42.16 71.88,42.16 71.88,48.52 70.1,48.52 68.84,49.78 68.84,54.1 v54.36,54.1 | v44.45,51.82 44.01,52.51 IC15.2 | v34.29,29.46 34.29,38.1 39.88,38.1 v39.88,44.7
  Bottom 0.2: v87.12,47.5 87.12,45.97 v81.53,45.97 | v54.36,54.1 51.94,51.82 v44.45,51.82 39.88,48.01 v39.88,44.7 | v34.29,13.97 v34.29,29.46
N$1
  Top 0.2: R40.1 85.34,18.03 85.34,19.81 92.96,19.81 92.96,11.47 97.79,11.47 TP1.TP | TP1.TP NTC1.1 TP1.TP
N$2
  Top 0.2: R21.2 C26.1 62.83,57.41 IC10.2
N$3
  Top 0.2: IC1.12 79.21,8.77 C2.1
N$4
  Top 0.2: R22.1 C27.1 62.83,57.91 IC10.3
N$5
  Top 0.2: IC1.5 75.48,12.4 arc-90 75.44,12.45 75.44,13.55 R2.2 R1.1
N$6
  Top 0.3: R3.2 C1.2
N$7
  Top 0.2: IC1.11 78.56,8.06 79.5,7.11 R4.2
N$8
  Top 0.2: IC1.9 77.26,8.17 75.69,6.6 R5.2
N$9
  Top 0.2: IC2.4 60.2,30.99 L1.1
N$10
  Top 0.2: IC2.2 59.18,30.99 L1.2
N$11
  Top 0.2: IC3.4 60.19,44.97 60.2,44.96 L2.1
N$12
  Top 0.2: IC3.2 59.18,44.96 L2.2
N$13  (via drill 0.3)
  Top 0.127: J3.9 16.66,20.06 | 16.66,20.06 v16.76,20.57 | J3.17 18.26,20.06 17.86,20.06 | 17.86,20.06 J3.15 | 17.06,20.06 17.86,20.06 | 17.06,20.06 J3.11 | 16.66,20.06 17.06,20.06 | 30.66,15.49 30.66,14.99 v30.48,14.99 | 30.66,15.49 J3.80 | J3.78 30.26,15.49 30.66,15.49 | 25.06,15.49 25.06,14.99 v24.89,14.99 24.26,14.99 J3.48 24.26,15.49 24.66,15.49 | 25.06,15.49 J3.52 | 24.66,15.49 J3.50 | 25.06,15.49 24.66,15.49
  Bottom 0.127: 16.76,21.59 C12.1 | C14.1 30.48,13.72 | 24.89,13.72 C13.1
  Bottom 0.3: 16.76,21.59 v16.76,20.57 18.03,19.81 19.56,19.81 v24.89,14.99 24.89,13.72 | 30.48,13.72 v30.48,14.99
  Bottom 0.406: C11.+ 36.45,13.87 v36.45,14.48
  other vias: 37.72,14.48 36.45,13.21 37.72,13.21
  pour Top (isolate 0.254): 24.13,15.49 40.89,15.49 40.89,8.13 36.83,8.13 36.83,12.45 24.13,12.45
N$14
  Top 0.3: R7.2 C16.2
N$15
  Top 0.2: R12.1 57.15,22.35 57.15,22.48 IC5.3
N$16
  Top 0.2: R9.1 64.63,26.84 IC5.8
N$17
  Top 0.2: R10.1 66.55,21.21 IC5.5
N$18
  Top 0.4: R6.2 C15.2
N$19
  Top 0.2: R11.1 58.42,20.32 58.42,21.21 IC5.4
N$20
  Top 0.2: IC8.1 81.58,53.09 78.49,53.09 | 78.49,53.09 R16.1 | 78.49,53.09 76.96,53.09 76.96,49.02 73.83,49.02 Q1.C
N$21  (via drill 0.3)
  Top 0.2: J5.3 85.09,63.5 86.2,62.39 IC6.6 IC6.1 86.2,59.53 v85.85,59.18 | IC7.14 88.15,59.42 v88.14,59.44
  Bottom 0.2: v88.14,59.44 87.88,59.18 v85.85,59.18
N$22  (via drill 0.3)
  Top 0.2: v86.74,63.25 IC6.5
  Top 0.3: v78.74,72.39 78.74,72.54 F1.1 | J5.1 86.69,63.3 arc90 v86.74,63.25 | C21.1 82.3,61.81 v82.3,63.25
  Bottom 0.3: v86.74,63.25 v82.3,63.25 78.74,63.25 v78.74,72.39
N$23  (via drill 0.3)
  Top 0.2: J5.2 85.89,64.03 arc90 v85.92,64.01 | v87.63,62.74 87.63,62.16 IC6.4 IC6.3 87.28,59.28 87.65,58.91 IC7.15
  Bottom 0.2: v85.92,64.01 87.63,64.01 v87.63,62.74
N$24  (via drill 0.3)
  Top 0.2: v85.09,44.45 R17.1 | v80.02,44.45 79.85,44.62 C25.1 76.18,44.62 Q1.B
  Bottom 0.2: v80.02,44.45 v85.09,44.45
N$25  (via drill 0.3)
  Top 0.2: IC9.1 88.2,46.23 85.6,46.23 R18.2 84.49,48.68 v84.32,48.01 | Q2.C 81.13,48.51 v81.3,48.01
  Bottom 0.2: v81.3,48.01 v84.32,48.01
N$26  (via drill 0.3)
  Top 0.2: R19.1 v76.33,50.8 | v77.6,50.8 77.92,50.48 Q2.B
  Bottom 0.2: v76.33,50.8 v77.6,50.8
N$27  (via drill 0.3)
  Top 0.2: IC7.30 89.66,53.07 89.66,52.07 v88.1,52.07 | v82.57,52.07 82.22,52.07 IC8.2
  Bottom 0.2: v82.57,52.07 v88.1,52.07
N$28  (via drill 0.3)
  Top 0.2: IC7.2 92.2,54.12 v92.2,54.61 | v92.2,52.58 92.37,52.41 R15.2
  Bottom 0.2: v92.2,52.58 v92.2,54.61
N$29
  Top 0.2: R15.1 93.64,50.8 91.95,50.8 91.44,51.31 90.17,51.31 89.73,50.62 IC9.6
N$30  (via drill 0.3)
  Top 0.2: IC8.6 82.88,56.39 80.52,56.39 80.01,55.88 v80.01,54.86 | v75.18,58.93 75.18,60.96 R14.1
  Bottom 0.2: v80.01,54.86 77.47,54.86 77.47,58.93 v75.18,58.93
N$31
  Top 0.2: 74.08,54.78 IC13.1 73.98,53.15 73.57,52.24 R19.2 | R19.2 73.15,51.22 | R20.1 arc-90 71.21,50.8 R19.2
N$32
  Top 0.2: IC10.6 55.12,57.91 55.12,59.94 R28.1
N$33
  Top 0.2: IC9.3 89.73,44.45 R17.2
N$34
  Top 0.2: L4.2 C32.1 C31.1 45.84,66.33 IC14.8
N$35
  Top 0.2: IC12.2 69.6,65.41 69.6,68.14 X1.1
N$36
  Top 0.2: R23.2 87.12,11.43 87.12,14.25 LED1.C
N$37
  Top 0.2: R24.2 87.12,8.89 87.12,7.14 LED2.C
N$38
  Top 0.2: IC14.6 47.43,67.64 47.24,67.82 46.14,69.59 46.08,69.6 45.22,69.6 J6.2
N$39
  Top 0.2: IC14.5 48.38,69.73 J6.3
N$40
  Top 0.2: IC14.4 50.8,68.41 50.8,69.6 J6.4
N$41
  Top 0.2: IC14.3 50.75,67.56 51.56,67.56 51.82,67.82 J6.5
N$42  (via drill 0.3)
  Top 0.2: J11.1 58.93,71.12 56.9,68.83 56.9,62.74 55.63,62.23 v51.82,62.23 | v40.39,56.64 40.39,53.16 IC15.6
  Bottom 0.2: v40.39,56.64 49.02,56.64 49.02,60.71 v51.82,62.23
N$43
  Top 0.3: R25.2 LED3.C
N$44
  Bottom 0.2: 12.19,57.27 TP3.TP 12.19,55.88 16.26,55.88 16.26,57.27 MICROSD.CD1
N$45
  Top 0.2: IC12.1 70.92,64.14 arc-90 X1.2
  Top 0.3: 70.92,64.14 X1.2
N$46
  Top 0.2: R29.1 IC12.7
N$47  (via drill 0.3)
  Top 0.127: J3.31 21.06,23.37 v20.83,24.13
  Bottom 0.127: v20.83,24.13 25.91,24.13 27.94,25.6 27.94,51.05 29.72,52.83 R26.1
N$48  (via drill 0.3)
  Top 0.127: J3.33 21.46,24.38 v21.59,24.89
  Bottom 0.127: v21.59,24.89 25.41,24.89 27.18,26.15 27.18,52.32 29.97,55.12 R27.1
N$49
  Top 0.2: IC2.7 arc90 IC2.7 60.2,35.43 62.74,35.43 arc90 62.83,35.52 R30.2 R31.2
N$50
  Top 0.2: R33.2 R32.2 62.83,49.74 arc-90 62.74,49.66 60.19,49.66 IC3.7
N$51
  Bottom 0.2: MICROSD.CD2 12.19,68.17 TP4.TP
N$52
  Top 0.2: LED4.C 50.8,49.95 R35.2
N$53
  Top 0.3: L5.1 F1.2
N$54  (via drill 0.3)
  Top 0.2: IC3.5 62.09,45.49 arc90 C5.1 | C5.1 64.26,45.63 64.26,45.09 L7.2 | v63.5,45.72 62.23,45.72 C5.1 | R32.1 C40.1 arc-90 59.69,50.63 IC3.8 59.69,50.8 59.44,50.8 59.44,52.32 v60.45,52.32
  Bottom 0.2: v60.45,52.32 63.5,49.28 v63.5,45.72
  pour Top (isolate 0.127, no thermals): 60.71,45.72 60.71,45.21 63.25,45.21 63.25,44.2 66.8,44.2 66.8,45.97 61.47,45.97 61.21,45.72
N$55  (via drill 0.3)
  Top 0.2: IC2.5 v63.5,31.75 | C39.1 R30.1 | C39.1 arc-90 59.69,36.41 IC2.8 | C39.1 59.52,38.1 v60.45,38.1
  Bottom 0.2: v63.5,31.75 63.5,35.05 v60.45,38.1
  pour Top (isolate 0.127, no thermals): 60.71,31.75 60.71,31.24 63.25,31.24 63.25,30.23 66.8,30.23 66.8,32 61.47,32 60.96,31.75
N$56  (via drill 0.3)
  Top 0.3: v79.5,19.05 D4.C | v75.69,19.05 D2.C D3.C 71.63,19.89 71.63,10.92 72.81,9.74 R37.1
  Bottom 0.3: v75.69,19.05 v79.5,19.05
N$57
  Top 0.2: IC1.15 80.59,11.76 82.8,13.47 84.84,13.47 85.43,14.06 R41.1
N$58
  Top 0.2: IC1.16 82.92,15.24 R41.2 R40.2
N$59  (via drill 0.3)
  Top 0.2: IC3.10 58.44,48.49 58.04,48.9 v57.66,48.9 | 57.91,45.49 IC3.1 | 57.91,45.49 57.91,45.47 | 57.91,45.49 57.15,45.49 57.15,45.72 56.13,45.72 v56.13,44.96
  Top 0.3: 57.15,45.47 C8.1 56.13,45.63
  Top 0.406: L8.2 52.89,45.27 52.96,45.34 55.12,45.34 C9.1 56.13,45.63 v56.13,44.96 56.13,45.47 57.15,45.47
  Bottom 0.2: v57.66,48.9 57.15,48.9 56.13,47.75 v56.13,44.96
  pour Top (isolate 0.127, no thermals): 58.67,45.21 58.67,45.72 58.17,45.72 57.91,45.97 52.32,45.97 52.32,43.18 53.85,43.18 53.85,45.21 55.63,45.21 55.75,44.45 56.52,44.45 56.64,45.21
NRESETIN  (via drill 0.3)
  Top 0.127: J3.2 15.06,17.45 14.99,17.53 12.95,17.53 12.7,17.78 v12.7,19.3 | v9.14,27.94 v9.14,33.53
  Bottom 0.127: v12.7,19.3 9.14,19.3 v9.14,27.94 | v9.14,33.53 9.14,48.26 J12.6
NRSTTODFLT  (via drill 0.3)
  Top 0.127: J3.4 15.46,17.81 15.24,18.03 14.48,18.03 14.22,18.29 v14.22,20.57 | v10.41,27.94 v10.41,33.53
  Bottom 0.127: v14.22,20.57 10.41,20.57 v10.41,27.94 | v10.41,33.53 10.41,50.8 J12.5
NSPI1_CS  (via drill 0.3)
  Top 0.127: J3.41 23.06,27.56 v23.11,27.56
  Top 0.2: v16.76,40.39 6.61,40.39 6.61,34.29 J10.4
  Bottom 0.127: v23.11,27.56 23.11,30.73 6.1,30.73 6.1,34.29 J10.4
  Bottom 0.2: MICROSD.2 23.73,48.01 16.76,48.01 v16.76,40.39
NSPI1_IRQ  (via drill 0.3)
  Top 0.127: J3.37 22.26,26.42 v21.59,26.42
  Bottom 0.127: v21.59,26.42 21.59,29.21 J10.6
PWEN  (via drill 0.3)
  Top 0.2: IC2.6 60.94,34.52 61.21,34.8 v64.77,34.8 | IC3.6 60.94,48.49 61.21,48.77 v64.77,48.77 | v65.28,29.46 67.31,29.46 67.31,24.89 J13.2
  Bottom 0.2: v64.77,48.77 v64.77,34.8 65.28,34.8 v65.28,29.46
RTS1  (via drill 0.3)
  Top 0.127: v16.01,14.22 v16,14.22 16.26,14.48 J3.8
  Bottom 0.127: v16,14.22 5.08,14.22 5.08,15.24 J7.4
RTS2  (via drill 0.3)
  Top 0.127: J3.26 19.86,10.92 17.78,10.92 v16.76,9.91
  Bottom 0.127: v16.76,9.91 16.51,9.65 J8.4
RX1  (via drill 0.3)
  Top 0.127: J3.10 16.66,13.46 v16.76,13.46
  Bottom 0.127: v16.76,13.46 5.07,13.46 5.08,12.7 J7.5
RX2  (via drill 0.3)
  Top 0.127: J3.28 20.26,9.91 v18.29,9.91
  Bottom 0.127: v18.29,9.91 17.53,10.92 15.75,10.92 15.75,5.59 13.97,5.59 J8.5
SPI1_CLK  (via drill 0.3)
  Top 0.127: J3.45 23.86,26.42 v24.64,26.42
  Top 0.2: v20.45,55.75 20.45,55.63 17.53,55.63 v17.53,53.85 | v14.22,43.42 4.58,43.42 4.58,39.37 J10.2
  Bottom 0.127: v24.64,26.42 24.64,32.26 8.13,32.26 8.13,39.37 J10.2
  Bottom 0.2: MICROSD.5 20.43,55.75 v20.45,55.75 | v17.53,53.85 14.22,53.85 v14.22,43.42
SPI1_MISO  (via drill 0.3)
  Top 0.127: J3.39 22.66,27.05 v22.35,27.05
  Top 0.2: v12.95,38.87 7.63,38.87 7.63,31.75 J10.5
  Bottom 0.127: v22.35,27.05 22.35,29.97 5.08,29.97 5.08,31.75 J10.5
  Bottom 0.2: MICROSD.7 18.29,57.27 18.29,55.63 17.53,54.86 12.95,54.86 v12.95,38.87
SPI1_MOSI  (via drill 0.3)
  Top 0.127: J3.43 23.46,27.05 v23.88,27.05
  Top 0.2: v15.49,41.9 5.6,41.9 5.6,36.83 J10.3
  Bottom 0.127: v23.88,27.05 23.88,31.5 7.11,31.5 7.11,36.83 J10.3
  Bottom 0.2: MICROSD.3 22.64,49.28 15.49,49.28 v15.49,41.9
SUSP  (via drill 0.3)
  Top 0.2: IC7.11 89.65,59.18 v92.71,59.18 95.16,59.18 arc90 R36.1
  Top 0.3: IC1.7 74.68,11.11 v74.68,9.14
  Bottom 0.2: v92.71,59.18 95.25,56.64 95.25,17.53 85.85,7.37 75.69,7.37 74.68,8.13 v74.68,9.14
TX1  (via drill 0.3)
  Top 0.127: v14.99,12.7 14.99,14.99 15.86,14.99 J3.6
  Bottom 0.127: J7.6 6.1,10.16 6.1,12.7 v14.99,12.7
TX2  (via drill 0.3)
  Top 0.127: J3.24 19.46,11.71 v16.76,11.68
  Bottom 0.127: v16.76,11.68 14.99,11.68 14.99,6.35 11.43,6.35 J8.6
VBAT  (via drill 0.3)
  Top 0.2: IC12.3 65.53,66.67 v65.53,67.06 | 66.55,60.96 69.35,60.96 69.35,50.04 70.36,49.03 72.34,49.03 72.34,42.93 v80.02,42.93 | C15.1 84.58,34.2 v84.58,40.39 | 66.55,60.96 v65.53,60.96 | 66.55,60.96 66.55,59.31 R22.2 R21.1
  Top 0.3: IC1.2 78.56,16 80.52,16 80.52,23.04 | 80.52,23.04 D4.A | 80.52,23.04 v80.52,23.88 | v84.58,30.73 84.58,34.2 | 84.58,34.2 | 84.58,34.2 86.35,34.2 C15.1 87.88,34.2 87.88,38.35 90.17,38.35 J1.1
  Bottom 0.2: v65.53,60.96 v65.53,67.06 | v84.58,40.39 84.58,42.93 v80.02,42.93
  Bottom 0.3: v80.52,23.88 80.52,30.73 v84.58,30.73
VBUS  (via drill 0.3)
  Top 0.2: LED2.A 91.43,10.64 91.43,17.75 LED1.A | IC1.3 77.91,18.29 v77.92,17.78 | LED1.A arc90 88.87,18.29 | v87.38,17.78 87.38,18.29 88.9,18.29 LED1.A | L7.1 68.39,44.96 70.1,44.96 70.1,32.51 73.66,32.51 | L6.2 73.66,30.86 C3.+ 71.88,32.4 | 71.88,32.4 71.88,31.5 | v71.88,30.48 71.88,31.4 71.88,32.4
  Top 0.3: IC1.3 77.91,24.2 v75.44,26.16 | v75.44,30.48 75.59,30.33 D1.C
  Top 0.4: C3.+ 77.47,32.41 C38.1
  Top 0.406: C3.+ 73.66,32.51
  Bottom 0.2: v77.92,17.78 v87.38,17.78 | J13.3 69.09,22.61 71.88,25.4 v71.88,30.48
  Bottom 0.3: v75.44,26.16 v75.44,30.48
  pour Top (isolate 0.2): 71.12,46.23 71.12,34.04 76.45,34.04 76.45,35.05 78.49,35.05 78.49,29.72 68.07,29.72 68.07,32.26 69.34,32.26 69.34,43.69 68.07,43.69 68.07,46.23
VUSB_3V3  (via drill 0.3)
  Top 0.2: C24.1 95.25,54.27 R36.2 93.31,57.57 92.33,58.55 v90.42,58.55 | C24.1 arc90 93.64,54.36 | IC7.16 87.15,58.39 v87,58.55 | IC7.1 91.23,53.59 92.96,53.59 93.64,54.27 C24.1 | v80.52,57.66 81.55,57.66 IC8.8 v80.52,57.66 | v80.52,57.66 78.49,57.66 R16.2 78.49,56.98 IC13.3 72.64,56.98 | 72.64,56.98 71.37,56.98 arc90 C30.1 | R20.2 72.22,52.41 72.64,53.34 72.64,56.98
  Bottom 0.2: v90.42,58.55 v87,58.55 86.36,58.42 81.28,58.42 v80.52,57.66 80.52,55.88 C33.1
VUSB_DEB  (via drill 0.3)
  Top 0.2: IC7.19 86.11,56.12 86.11,56.13
  Top 0.3: IC1.1 79.21,14.18 v79.5,14.48 80.77,14.48 81.79,15.49 v81.79,19.3 | v76.96,14.48 77.26,14.18 IC1.4 | v81.79,28.7 81.03,28.7 81.03,38.44 C1.1 v82.55,39.62 | D3.A 71.96,23.11 v73.66,23.11 | L5.2 76.2,60.11 C22.1 C23.1 81.18,58.93 83.82,58.93 85.09,57.66 85.09,57.15 86.11,56.13 85.6,56.13 85.34,55.88 85.34,52.83 83.06,51.05 83.06,45.25 82.55,44.74 v82.55,41.41
  Bottom 0.3: v79.5,14.48 v76.96,14.48 76.96,15.75 73.66,19.05 v73.66,23.11 | v81.79,19.3 v81.79,28.7 | v82.55,39.62 v82.55,41.41
VWALL  (via drill 0.3)
  Top 0.2: v75.69,24.38 D2.A 76.53,23.04 76.96,22.35 76.96,18.54 75.53,17.36 R1.2 | D1.A arc90 77.62,26.92 79.25,26.92 v79.25,24.89
  Bottom 0.2: v75.69,24.38 76.96,24.89 v79.25,24.89
  pour Top (isolate 0.2): 76.45,27.94 78.49,27.94 78.49,27.43 85.09,27.43 85.09,29.97 88.65,29.97 88.65,23.88 85.09,23.88 85.09,26.42 77.46,26.42 76.45,26.92
W_LINKLED  (via drill 0.3)  (1 unrouted)
  Top 0.127: J3.25 19.86,20.07 19.81,20.07 v19.81,23.11
  Top 0.2: v37.34,51.31 38.06,53.81 IC15.5 38.1,53.81 38.1,59.69 R34.1
  Bottom 0.127: v19.81,23.11 26.16,23.11 28.7,24.77 28.7,49.78 30.23,51.31 v37.34,51.31
WKUP  (via drill 0.3)
  Top 0.127: v11.68,27.94 v11.68,33.53 | J3.46 23.86,12.95 v24.38,12.45
  Bottom 0.127: v24.38,12.45 23.62,13.21 23.62,14.99 19.3,18.8 15.24,18.8 15.24,21.84 11.68,21.84 v11.68,27.94 | v11.68,33.53 11.68,53.34 J12.4
WLNK  (via drill 0.3)
  Top 0.3: 6.1,58.42 J12.2 | 6.1,58.42 6.1,46.48 v19.05,46.48 | IC15.3 43.76,53.16 v44.45,53.98 | v36.32,53.98 33.02,53.98 33.02,49.78 29.72,46.48 v24.89,46.48 | R25.1 9.91,71.37 9.91,67.56 6.1,64.01 6.1,58.42
  Bottom 0.3: v19.05,46.48 v24.89,46.48 | v36.32,53.98 v44.45,53.98

### Text on the board
tPlace: PW_portable_R02 | 2012/03/12 H.K